# EAGLE design tester_adapter_board (EAGLE 9.6.2)
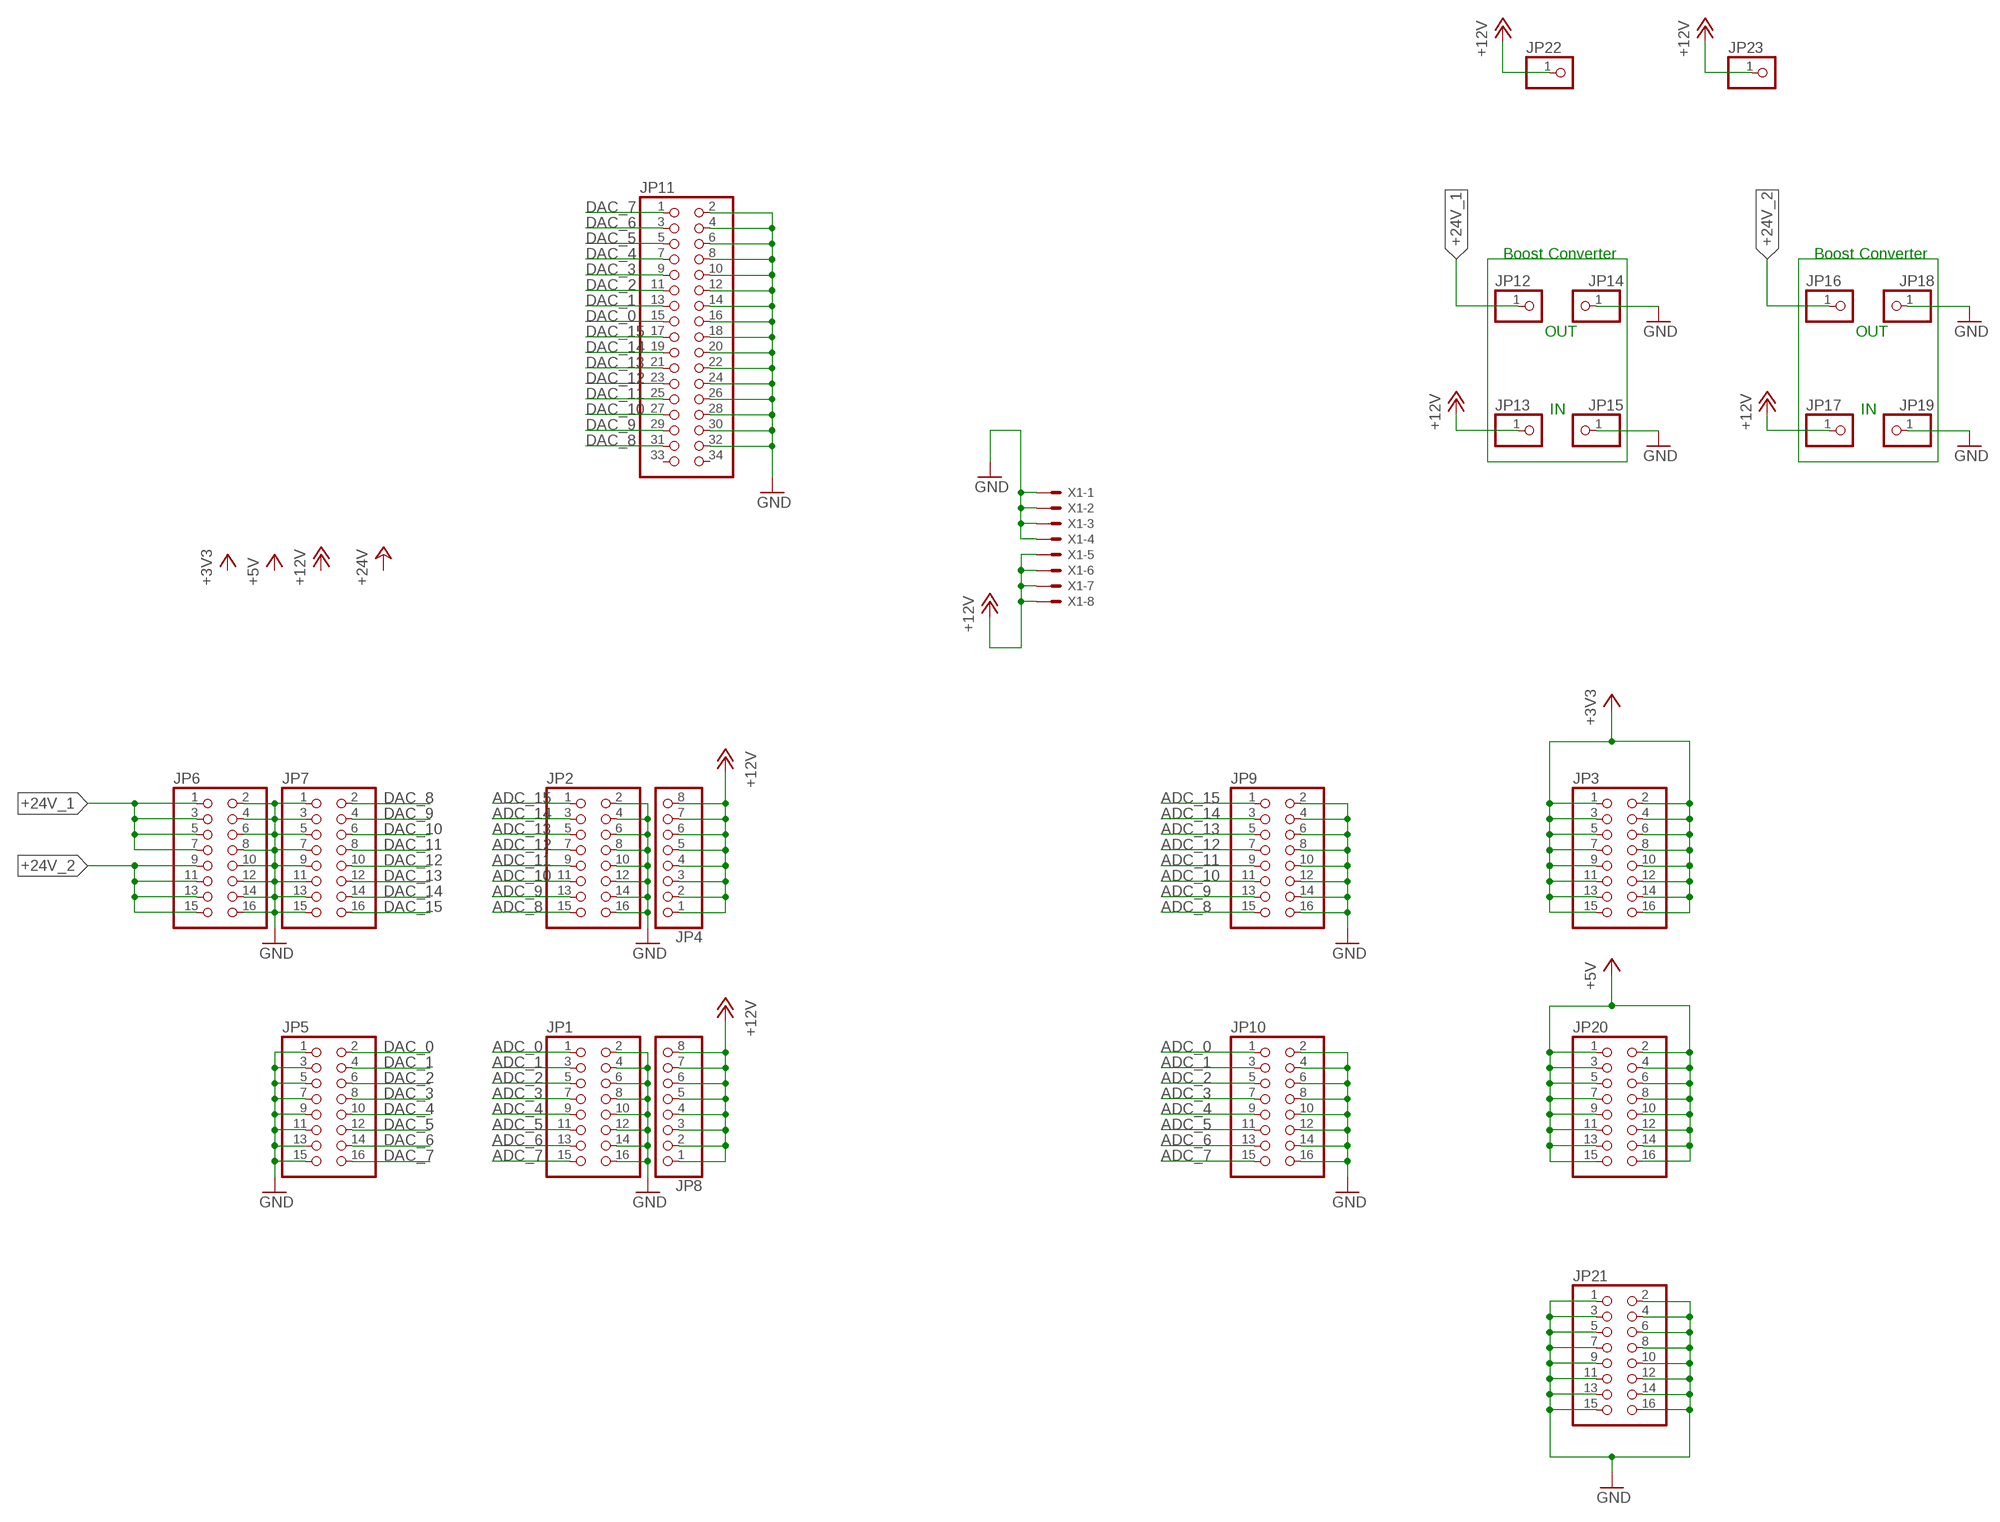
[diagram p0: schematic, sheet 1]

## Parts
JP1  PINHD-2X8  [2X08]
JP2  PINHD-2X8  [2X08]
JP3  PINHD-2X8  [2X08]
JP4  PINHD-1X08_2.54-S  [1X08-S]
JP5  PINHD-2X8  [2X08]
JP6  PINHD-2X8  [2X08]
JP7  PINHD-2X8  [2X08]
JP8  PINHD-1X08_2.54-S  [1X08-S]
JP9  PINHD-2X8  [2X08]
JP10  PINHD-2X8  [2X08]
JP11  PINHD-2X17  [2X17]
JP12  PINHD-1X01_2.54  [1X01]
JP13  PINHD-1X01_2.54  [1X01]
JP14  PINHD-1X01_2.54-S  [1X01-S]
JP15  PINHD-1X01_2.54-S  [1X01-S]
JP16  PINHD-1X01_2.54  [1X01]
JP17  PINHD-1X01_2.54  [1X01]
JP18  PINHD-1X01_2.54-S  [1X01-S]
JP19  PINHD-1X01_2.54-S  [1X01-S]
JP20  PINHD-2X8  [2X08]
JP21  PINHD-2X8  [2X08]
JP22  PINHD-1X01_2.54-SMD  [1X01SMD]
JP23  PINHD-1X01_2.54-SMD  [1X01SMD]
X1  5566-8  [5566-8]

## Nets
+3V3: JP3.1 JP3.2 JP3.3 JP3.4 JP3.5 JP3.6 JP3.7 JP3.8 JP3.9 JP3.10 JP3.11 JP3.12 JP3.13 JP3.14 JP3.15 JP3.16
+5V: JP20.1 JP20.2 JP20.3 JP20.4 JP20.5 JP20.6 JP20.7 JP20.8 JP20.9 JP20.10 JP20.11 JP20.12 JP20.13 JP20.14 JP20.15 JP20.16
+12V: JP4.1 JP4.2 JP4.3 JP4.4 JP4.5 JP4.6 JP4.7 JP4.8 JP8.1 JP8.2 JP8.3 JP8.4 JP8.5 JP8.6 JP8.7 JP8.8 JP13.1 JP17.1 JP22.1 JP23.1 X1.5 X1.6 X1.7 X1.8
+24V_1: JP6.1 JP6.3 JP6.5 JP6.7 JP12.1
+24V_2: JP6.9 JP6.11 JP6.13 JP6.15 JP16.1
ADC_0: JP1.1 JP10.1
ADC_1: JP1.3 JP10.3
ADC_2: JP1.5 JP10.5
ADC_3: JP1.7 JP10.7
ADC_4: JP1.9 JP10.9
ADC_5: JP1.11 JP10.11
ADC_6: JP1.13 JP10.13
ADC_7: JP1.15 JP10.15
ADC_8: JP2.15 JP9.15
ADC_9: JP2.13 JP9.13
ADC_10: JP2.11 JP9.11
ADC_11: JP2.9 JP9.9
ADC_12: JP2.7 JP9.7
ADC_13: JP2.5 JP9.5
ADC_14: JP2.3 JP9.3
ADC_15: JP2.1 JP9.1
DAC_0: JP5.2 JP11.15
DAC_1: JP5.4 JP11.13
DAC_2: JP5.6 JP11.11
DAC_3: JP5.8 JP11.9
DAC_4: JP5.10 JP11.7
DAC_5: JP5.12 JP11.5
DAC_6: JP5.14 JP11.3
DAC_7: JP5.16 JP11.1
DAC_8: JP7.2 JP11.31
DAC_9: JP7.4 JP11.29
DAC_10: JP7.6 JP11.27
DAC_11: JP7.8 JP11.25
DAC_12: JP7.10 JP11.23
DAC_13: JP7.12 JP11.21
DAC_14: JP7.14 JP11.19
DAC_15: JP7.16 JP11.17
GND: JP1.2 JP1.4 JP1.6 JP1.8 JP1.10 JP1.12 JP1.14 JP1.16 JP2.2 JP2.4 JP2.6 JP2.8 JP2.10 JP2.12 JP2.14 JP2.16 JP5.1 JP5.3 JP5.5 JP5.7 JP5.9 JP5.11 JP5.13 JP5.15 JP6.2 JP6.4 JP6.6 JP6.8 JP6.10 JP6.12 JP6.14 JP6.16 JP7.1 JP7.3 JP7.5 JP7.7 JP7.9 JP7.11 JP7.13 JP7.15 JP9.2 JP9.4 JP9.6 JP9.8 JP9.10 JP9.12 JP9.14 JP9.16 JP10.2 JP10.4 JP10.6 JP10.8 JP10.10 JP10.12 JP10.14 JP10.16 JP11.2 JP11.4 JP11.6 JP11.8 JP11.10 JP11.12 JP11.14 JP11.16 JP11.18 JP11.20 JP11.22 JP11.24 JP11.26 JP11.28 JP11.30 JP11.32 JP14.1 JP15.1 JP18.1 JP19.1 JP21.1 JP21.2 JP21.3 JP21.4 JP21.5 JP21.6 JP21.7 JP21.8 JP21.9 JP21.10 JP21.11 JP21.12 JP21.13 JP21.14 JP21.15 JP21.16 X1.1 X1.2 X1.3 X1.4
Unconnected: JP11.33 JP11.34

## Notes on the sheet
- Boost Converter | Boost Converter
- OUT | OUT
- IN | IN

## Library data of the parts
JP1-JP3 JP5-JP7 JP9 JP10 JP20 JP21 = pinhead:PINHD-2X8: PIN HEADER
JP4 JP8 = pinhead-2:PINHD-1X08: PIN HEADER
JP11 = pinhead:PINHD-2X17: PIN HEADER
JP12-JP19 JP22 JP23 = pinhead-2:PINHD-1X01: PIN HEADER
X1 = con-molex:5566-8: Mini FIT connector 8 pol Source: http://www.molex.com; MF: MOLEX; OC_FARNELL: unknown; OC_NEWARK: unknown

## Board
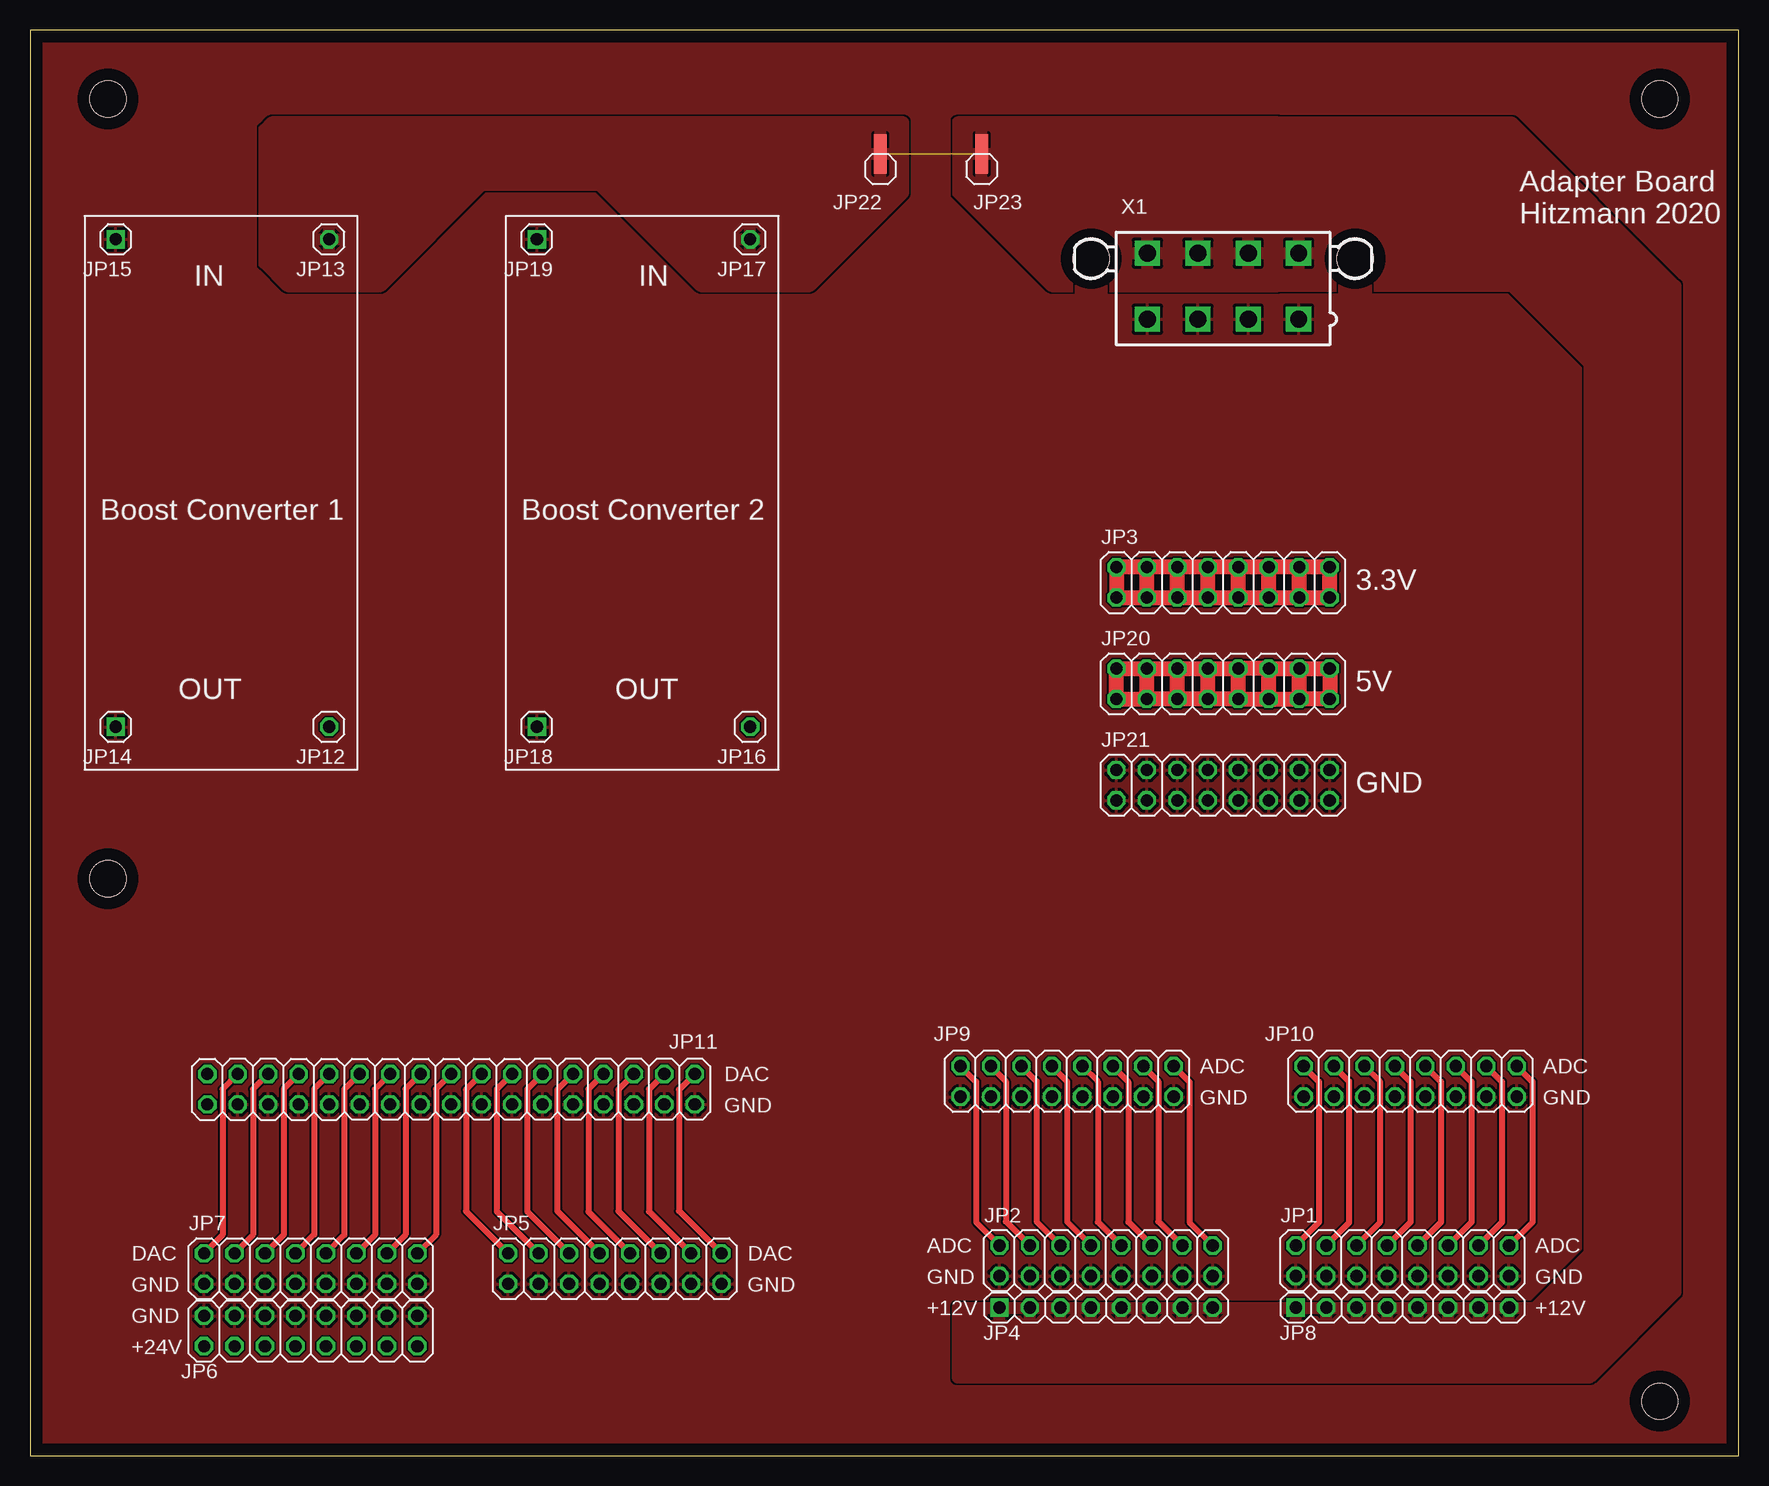
[diagram p1: board, top side]
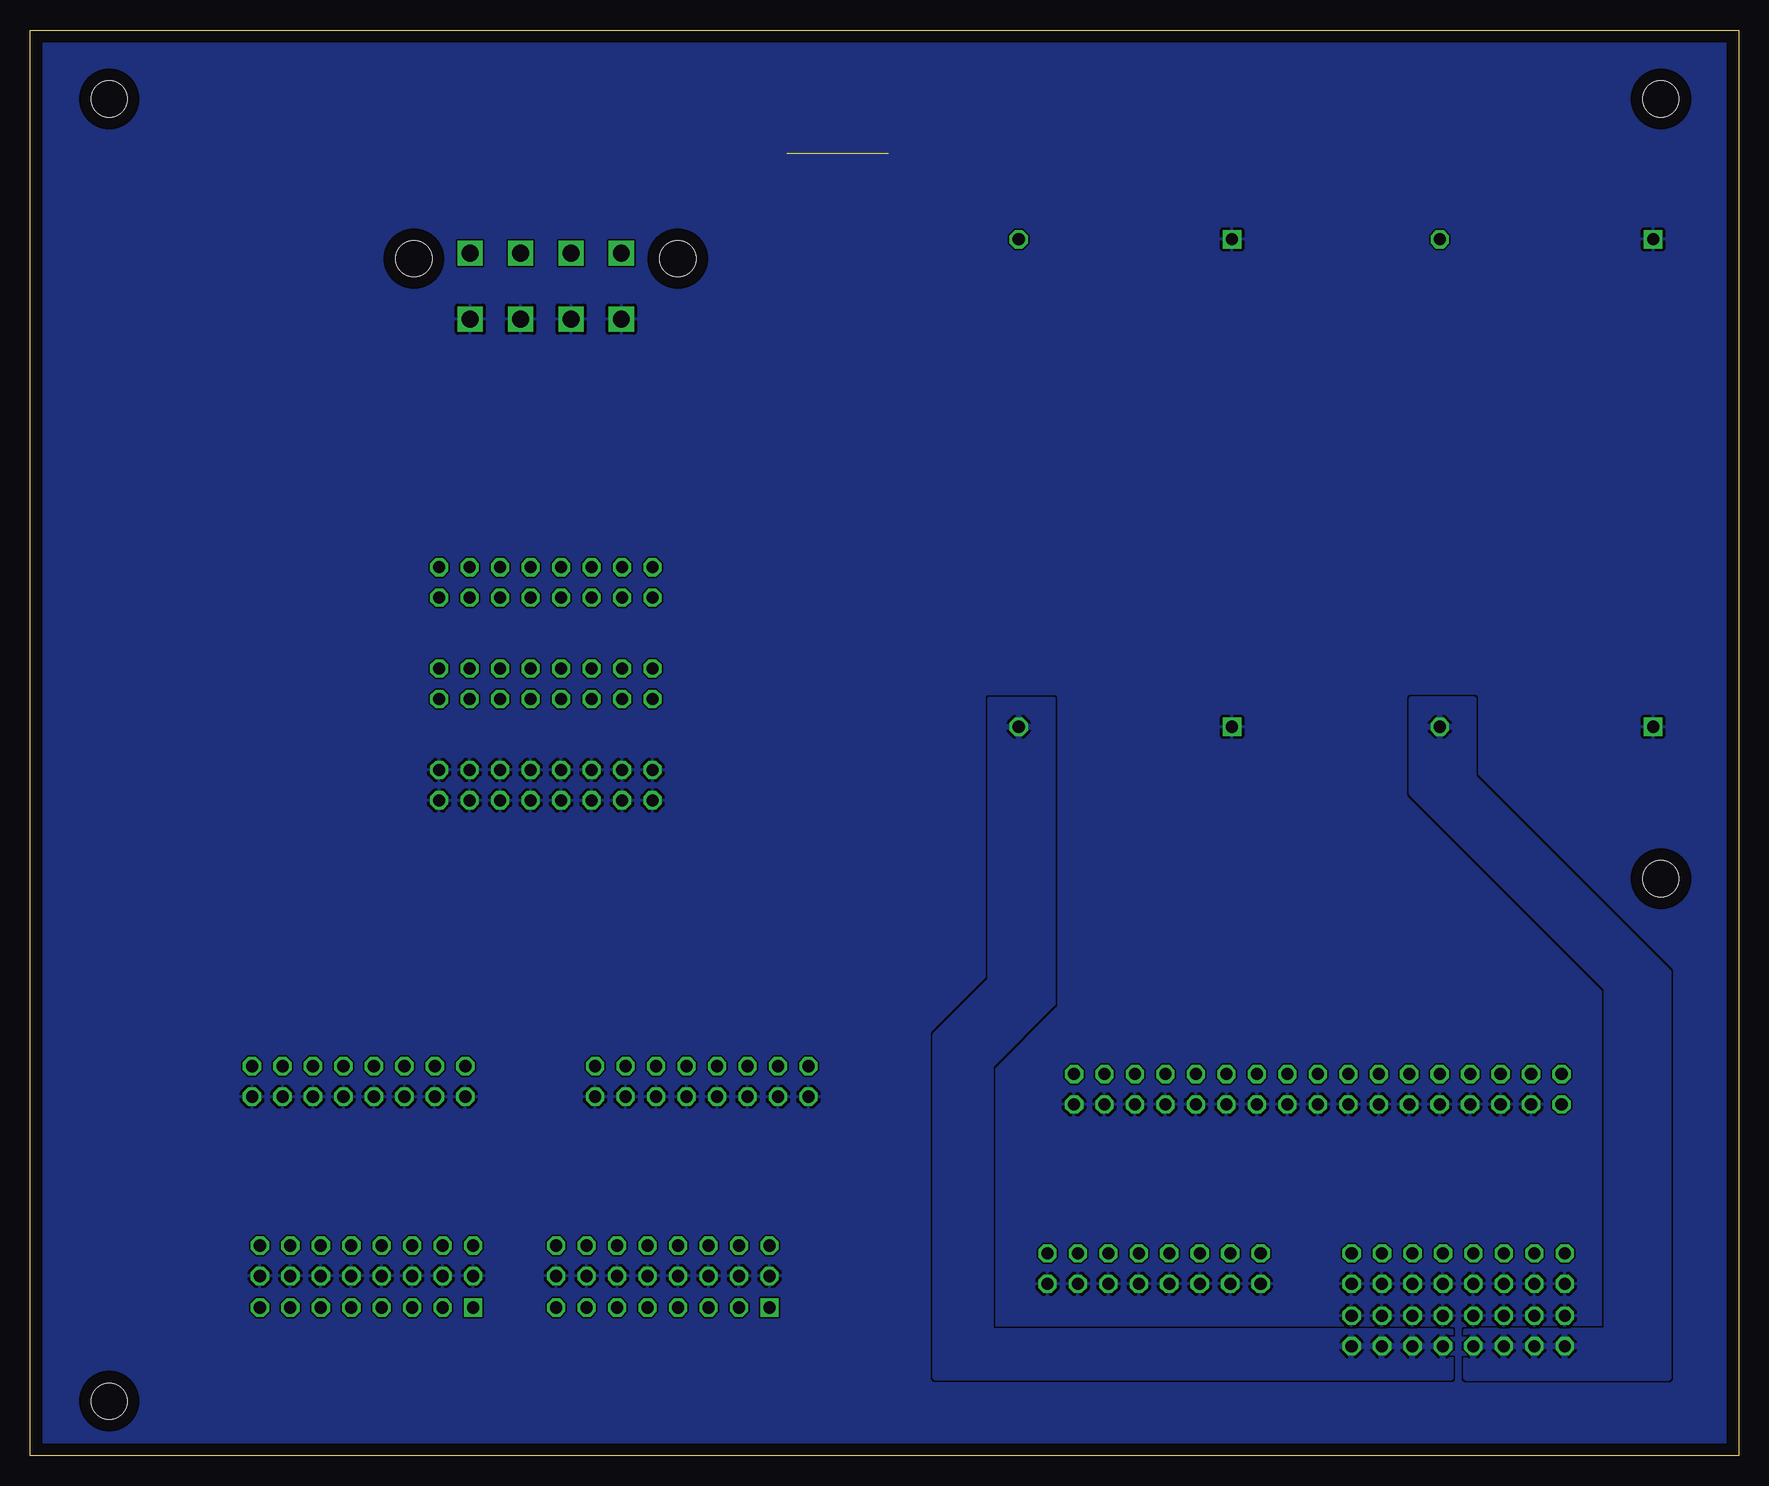
[diagram p2: board, bottom side, seen from below]

Size 142.45 x 118.85 mm. Coordinates in mm from the lower left corner, seen from the top.
Outline: 0,0 142.45,0 142.45,118.85 0,118.85 0,0
Copper layers (1*16): Top 0.035mm / dielectric 1.5mm / Bottom 0.035mm
Design rules "default": minimum track width 6mil, minimum drill 0.35mm, track to track 6mil, track to pad 6mil, pad to pad 6mil, via to via 6mil, smd to smd 6mil, copper to edge 40mil, drill to drill 6mil, minimum pad ring 10mil, minimum via ring 8mil, stop-mask expansion 4mil, vias tented up to drill 0mil, thermal gap 10mil
Holes 3 mm at 6.5,113.1 135.85,113.1 135.85,4.55 6.5,48.1

### Footprints (pad centres in the part's own frame; a part is rotated, then mirrored left to right if it is on the bottom)
2X08 = drill 1.016 octagon: 1 -8.89,-1.27; 2 -8.89,1.27; 3 -6.35,-1.27; 4 -6.35,1.27; 5 -3.81,-1.27; 6 -3.81,1.27; 7 -1.27,-1.27; 8 -1.27,1.27; 9 1.27,-1.27; 10 1.27,1.27; 11 3.81,-1.27; 12 3.81,1.27; 13 6.35,-1.27; 14 6.35,1.27; 15 8.89,-1.27; 16 8.89,1.27
1X08-S = drill 1.016 square: 1 -8.89,0 | drill 1.016 octagon: 2 -6.35,0; 3 -3.81,0; 4 -1.27,0; 5 1.27,0; 6 3.81,0; 7 6.35,0; 8 8.89,0
2X17 = drill 1.016 octagon: 1 -20.32,-1.27; 2 -20.32,1.27; 3 -17.78,-1.27; 4 -17.78,1.27; 5 -15.24,-1.27; 6 -15.24,1.27; 7 -12.7,-1.27; 8 -12.7,1.27; 9 -10.16,-1.27; 10 -10.16,1.27; 11 -7.62,-1.27; 12 -7.62,1.27; 13 -5.08,-1.27; 14 -5.08,1.27; 15 -2.54,-1.27; 16 -2.54,1.27; 17 0,-1.27; 18 0,1.27; 19 2.54,-1.27; 20 2.54,1.27; 21 5.08,-1.27; 22 5.08,1.27; 23 7.62,-1.27; 24 7.62,1.27; 25 10.16,-1.27; 26 10.16,1.27; 27 12.7,-1.27; 28 12.7,1.27; 29 15.24,-1.27; 30 15.24,1.27; 31 17.78,-1.27; 32 17.78,1.27; 33 20.32,-1.27; 34 20.32,1.27
1X01 = drill 1.016 octagon: 1 0,0
1X01-S = drill 1.016 square: 1 0,0
1X01SMD = smd 1.016 x 3.302: 1 -1.27,1.27
5566-8 = drill 1.4 square: 1 6.3,-2.75; 2 2.1,-2.75; 3 -2.1,-2.75; 4 -6.3,-2.75; 5 6.3,2.75; 6 2.1,2.75; 7 -2.1,2.75; 8 -6.3,2.75 | hole 3: 11,2.29; -11,2.29

### Placement (x,y rotation side)
JP1  114.4,16.25 180 top
JP2  89.7,16.25 180 top
JP3  99.45,72.8 0 top
JP4  89.7,12.35 0 top
JP5  48.75,15.6 0 top
JP6  23.4,10.4 0 top
JP7  23.4,15.6 0 top
JP8  114.4,12.35 0 top
JP9  86.45,31.2 180 top
JP10  115.05,31.2 180 top
JP11  35.1,30.55 180 top
JP12  24.93,60.76 180 top
JP13  24.93,101.4 180 top
JP14  7.15,60.76 180 top
JP15  7.15,101.4 180 top
JP16  60.03,60.76 180 top
JP17  60.03,101.4 180 top
JP18  42.25,60.76 180 top
JP19  42.25,101.4 180 top
JP20  99.45,64.35 0 top
JP21  99.45,55.9 0 top
JP22  72.15,107.25 0 top
JP23  80.6,107.25 0 top
X1  99.45,97.5 0 top

### Tracks (layer width: path | path; a pad name or v marks a point on that pad's centre or on a via)
+3V3
  Top 1.27: JP3.14 JP3.16 JP3.15 JP3.13 | JP3.14 JP3.12 | JP3.12 JP3.10 | JP3.10 JP3.8 | JP3.8 JP3.6 | JP3.6 JP3.4 | JP3.4 JP3.2 JP3.1 JP3.3 | JP3.3 JP3.5 | JP3.5 JP3.7 | JP3.7 JP3.9 | JP3.9 JP3.11 | JP3.11 JP3.13 | JP3.13 JP3.14 | JP3.11 JP3.12 | JP3.9 JP3.10 | JP3.7 JP3.8 | JP3.5 JP3.6 | JP3.3 JP3.4
+5V
  Top 1.27: JP20.4 JP20.2 JP20.1 JP20.3 | JP20.4 JP20.6 | JP20.6 JP20.8 | JP20.8 JP20.10 | JP20.12 JP20.10 | JP20.12 JP20.14 | JP20.14 JP20.16 JP20.15 JP20.13 | JP20.11 JP20.13 | JP20.9 JP20.11 | JP20.5 JP20.3 | JP20.7 JP20.5 | JP20.9 JP20.7 | JP20.3 JP20.4 | JP20.5 JP20.6 | JP20.7 JP20.8 | JP20.9 JP20.10 | JP20.11 JP20.12 | JP20.13 JP20.14
+12V  (1 unrouted)
  pour Top (isolate 0.305, rank 2): 19.5,110.5 19.5,99.45 21.45,97.5 29.25,97.5 37.7,105.95 47.45,105.95 55.9,97.5 65,97.5 72.8,105.3 72.8,111.15 20.15,111.15
  pour Top (isolate 0.305): 104,97.5 104,111.15 77.35,111.15 77.35,105.3 85.15,97.5
  pour Top (isolate 0.305, rank 2): 104,97.5 104,111.15 123.5,111.15 137.15,97.5 137.15,13.65 130,6.5 77.35,6.5 77.35,12.35 125.45,12.35 130,16.9 130,91 123.5,97.5
+24V_1
  pour Bottom (isolate 0.305, rank 2): 22.1,63.05 27.3,63.05 27.3,55.25 11.05,39 11.05,10.4 22.75,10.4 22.75,6.5 5.85,6.5 5.85,40.3 22.1,56.55
+24V_2
  pour Bottom (isolate 0.305, rank 2): 57.2,63.05 57.2,37.7 62.4,32.5 62.4,10.4 24.05,10.4 24.05,6.5 66.95,6.5 66.95,35.1 62.4,39.65 62.4,63.05
ADC_0
  Top 0.508: JP10.1 125.24,31.17 125.24,19.47 JP1.1
ADC_1
  Top 0.508: JP10.3 122.7,31.17 122.7,19.47 JP1.3
ADC_2
  Top 0.508: JP10.5 120.16,31.17 120.16,19.47 JP1.5
ADC_3
  Top 0.508: JP10.7 117.62,31.17 117.62,19.47 JP1.7
ADC_4
  Top 0.508: JP10.9 115.08,31.17 115.08,19.47 JP1.9
ADC_5
  Top 0.508: JP10.11 112.5,31.21 112.5,19.43 JP1.11
ADC_6
  Top 0.508: JP10.13 109.95,31.22 109.95,19.42 JP1.13
ADC_7
  Top 0.508: JP10.15 107.45,31.18 107.45,19.46 JP1.15
ADC_8
  Top 0.508: JP9.15 78.86,31.17 78.86,19.47 JP2.15
ADC_9
  Top 0.508: JP9.13 81.35,31.22 81.35,19.52 JP2.13
ADC_10
  Top 0.508: JP9.11 83.9,31.21 83.9,19.51 JP2.11
ADC_11
  Top 0.508: JP9.9 86.45,31.2 86.45,19.5 JP2.9
ADC_12
  Top 0.508: JP9.7 89,31.19 89,19.49 JP2.7
ADC_13
  Top 0.508: JP9.5 91.55,31.18 91.55,19.48 JP2.5
ADC_14
  Top 0.508: JP9.3 94.05,31.22 94.05,19.52 JP2.3
ADC_15
  Top 0.508: JP9.1 96.65,31.16 96.65,19.46 JP2.1
DAC_0
  Top 0.508: JP11.15 36.35,30.53 36.35,20.38 JP5.2
DAC_1
  Top 0.508: JP11.13 38.9,30.54 38.9,20.37 JP5.4
DAC_2
  Top 0.508: JP11.11 41.45,30.55 41.45,20.36 JP5.6
DAC_3
  Top 0.508: JP11.9 43.95,30.51 43.95,20.4 JP5.8
DAC_4
  Top 0.508: JP11.7 46.55,30.57 46.55,20.34 JP5.10
DAC_5
  Top 0.508: JP11.5 49.05,30.53 49.05,20.38 JP5.12
DAC_6
  Top 0.508: JP11.3 51.6,30.54 51.6,20.37 JP5.14
DAC_7
  Top 0.508: JP11.1 54.1,30.5 54.1,20.41 JP5.16
DAC_8
  Top 0.508: JP11.31 16.05,30.55 16.05,18.41 JP7.2
DAC_9
  Top 0.508: JP11.29 18.6,30.56 18.6,18.42 JP7.4
DAC_10
  Top 0.508: JP11.27 21.15,30.57 21.15,18.43 JP7.6
DAC_11
  Top 0.508: JP11.25 23.7,30.58 23.7,18.44 JP7.8
DAC_12
  Top 0.508: JP11.23 26.2,30.54 26.2,18.4 JP7.10
DAC_13
  Top 0.508: JP11.21 28.75,30.55 28.75,18.41 JP7.12
DAC_14
  Top 0.508: JP11.19 31.3,30.56 31.3,18.42 JP7.14
DAC_15
  Top 0.508: JP11.17 33.85,30.57 33.85,18.43 JP7.16
GND
  pour Top (rank 3): -2.6,-2.6 143.65,-2.6 143.65,121.55 -2.6,121.55
  pour Bottom (rank 3): -1.3,-1.3 143,-1.3 143,120.25 -1.3,120.25

### Text on the board
tNames: Adapter Board / Hitzmann 2020 | IN | IN | Boost Converter 1 | Boost Converter 2 | 3.3V | 5V | OUT | OUT | GND | ADC | ADC | DAC | GND | GND | GND | ADC | ADC | DAC | DAC | GND | GND | GND | GND | +12V | +12V | GND | +24V